# Altium schematic sheet Oszillator.SchDoc
size A4
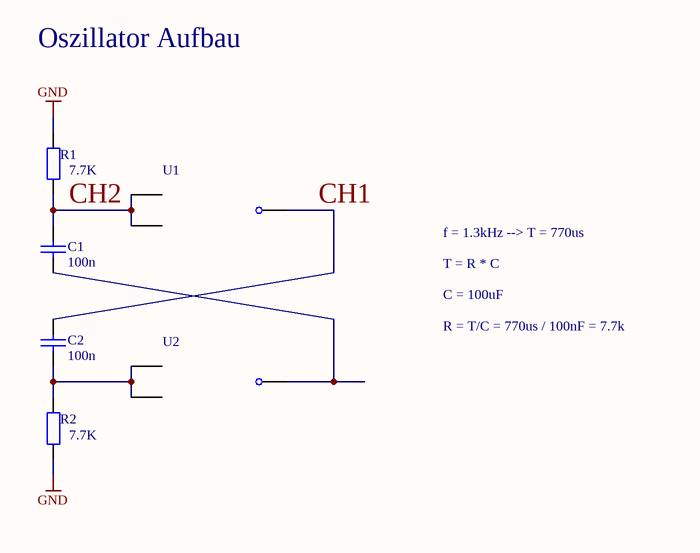
[diagram p0: Oszillator.SchDoc]

## Parts
C1  value 100n  (hidden comment: Capacitor)
C2  value 100n  (hidden comment: Capacitor)
R1  value 7.7K  [AXIAL-0.4]  (hidden comment: Res2)
R2  value 7.7K  [AXIAL-0.4]  (hidden comment: Res2)
U1  Digital NAND Gate  (value not drawn)
U2  Digital NAND Gate  (value not drawn)

## Nets
GND: R1.2 R2.2
CH1: C2.1 U1.3
CH2: C1.2 R1.1 U1.1 U1.2
NetC1_1: C1.1 U2.3
NetC2_2: C2.2 R2.1 U2.1 U2.2

## Notes on the sheet
- Oszillator Aufbau
- f = 1.3kHz --> T = 770us
- T = R * C
- C = 100uF
- R = T/C = 770us / 100nF = 7.7k

## Library data of the parts
C1 C2 = Capacitor: SimulationGenericComponent: True
R1 R2 = Res2: Resistor; Published: 8-Jun-2000; LatestRevisionDate: 17-Jul-2002; LatestRevisionNote: Re-released for DXP Platform.; PackageReference: AXIAL-0.4; Publisher: Altium Limited; PackageDescription: Axial Device, Thru-Hole; 2 Leads; 0.4 in Pin Spacing
U1 U2 = Digital NAND: rise_delay_inst: 1n; input_load_inst: 1p; adc_in_low_inst: 0; adc_in_high_inst: 1; dac_out_undef_inst: 0.5; SimulationGenericComponent: True; fall_delay_inst: 1n; adc_rise_delay_inst: 1n; adc_fall_delay_inst: 1n; dac_out_low_inst: 0; dac_out_high_inst: 1; dac_input_load_inst: 1p; dac_t_rise_inst: 1n; dac_t_fall_inst: 1n